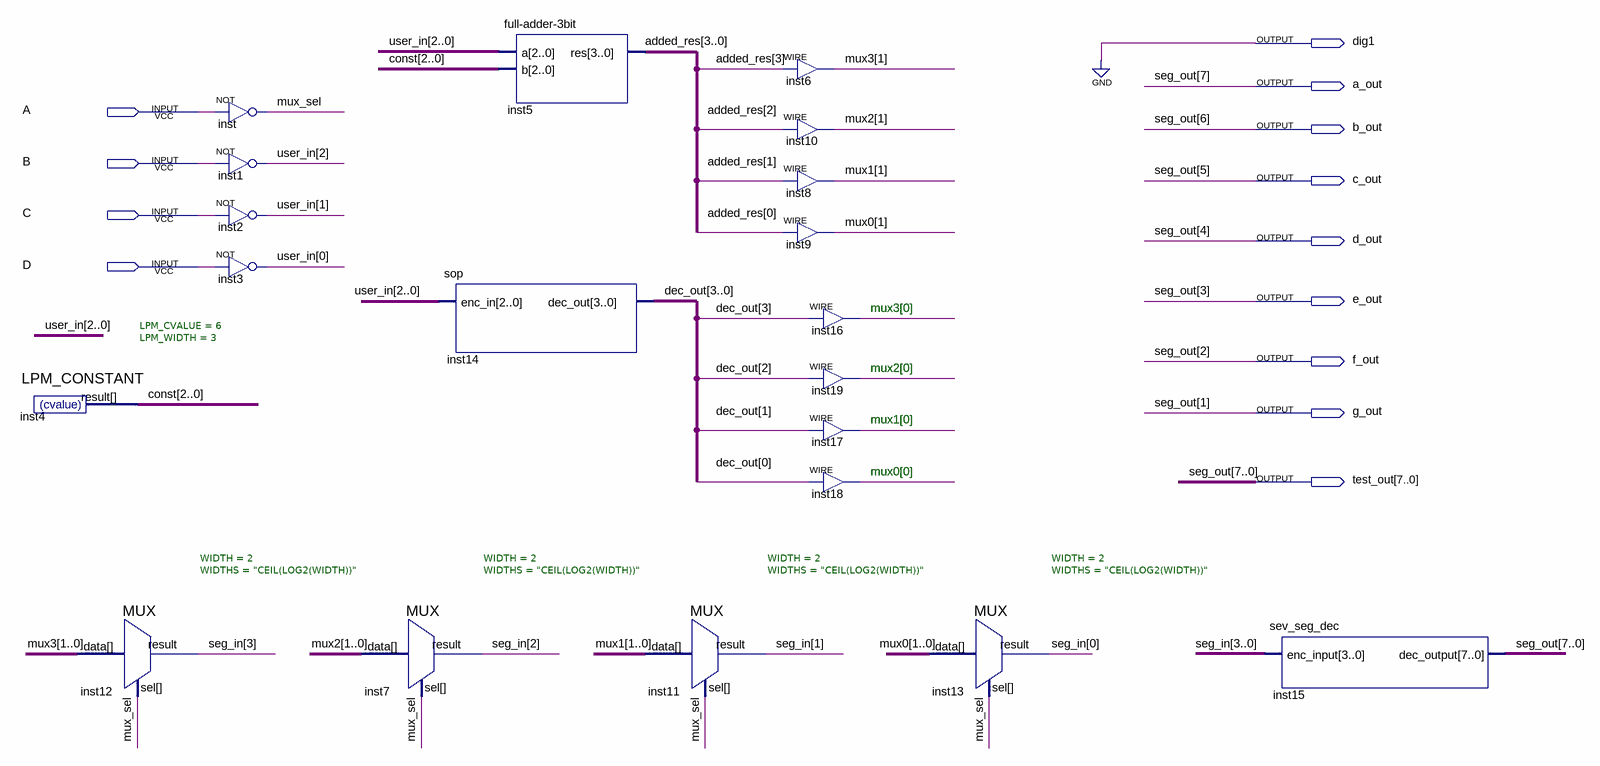
[diagram p0: schematic sheet]
// Quartus schematic full_scheme.bdf as structural Verilog: 20 symbols, 13 pins
module full_scheme (
  input  A,
  input  B,
  input  C,
  input  D,
  output dig1,
  output a_out,
  output b_out,
  output c_out,
  output d_out,
  output e_out,
  output f_out,
  output g_out,
  output [7:0] test_out
);

  wire mux_sel;
  wire [1:0] mux0, mux1, mux2, mux3;
  wire [2:0] \const , user_in;
  wire [3:0] added_res, dec_out, seg_in;

  LPM_CONSTANT #(.LPM_CVALUE(6), .LPM_WIDTH(3)) inst4 (.result(\const ));
  MUX #(.WIDTH(2), .WIDTHS("CEIL(LOG2(WIDTH))")) inst12 (.data(mux3), .sel(mux_sel), .result(seg_in[3]));
  not inst (mux_sel, A);
  not inst1 (user_in[2], B);
  not inst2 (user_in[1], C);
  not inst3 (user_in[0], D);
  MUX #(.WIDTH(2), .WIDTHS("CEIL(LOG2(WIDTH))")) inst7 (.data(mux2), .sel(mux_sel), .result(seg_in[2]));
  sop inst14 (.enc_in(user_in), .dec_out(dec_out));
  \full-adder-3bit  inst5 (.a(user_in), .b(\const ), .res(added_res));
  MUX #(.WIDTH(2), .WIDTHS("CEIL(LOG2(WIDTH))")) inst11 (.data(mux1), .sel(mux_sel), .result(seg_in[1]));
  assign mux3[1] = added_res[3];  // WIRE inst6
  assign mux2[1] = added_res[2];  // WIRE inst10
  assign mux1[1] = added_res[1];  // WIRE inst8
  assign mux0[1] = added_res[0];  // WIRE inst9
  assign mux3[0] = dec_out[3];  // WIRE inst16
  assign mux2[0] = dec_out[2];  // WIRE inst19
  assign mux1[0] = dec_out[1];  // WIRE inst17
  assign mux0[0] = dec_out[0];  // WIRE inst18
  MUX #(.WIDTH(2), .WIDTHS("CEIL(LOG2(WIDTH))")) inst13 (.data(mux0), .sel(mux_sel), .result(seg_in[0]));
  sev_seg_dec inst15 (.enc_input(seg_in), .dec_output({a_out, b_out, c_out, d_out, e_out, f_out, g_out, test_out[0]}));

  assign dig1 = 1'b0;
  assign test_out[7:1] = {a_out, b_out, c_out, d_out, e_out, f_out, g_out};

  // Other names for the same wires on the sheet: seg_out[7:0] = {a_out, b_out, c_out, d_out, e_out, f_out, g_out, test_out[0]}

  // Notes on the sheet:
  //   mux3[0]
  //   mux2[0]
  //   mux1[0]
  //   mux0[0]
endmodule
